# EAGLE design BVP (EAGLE 5.11)
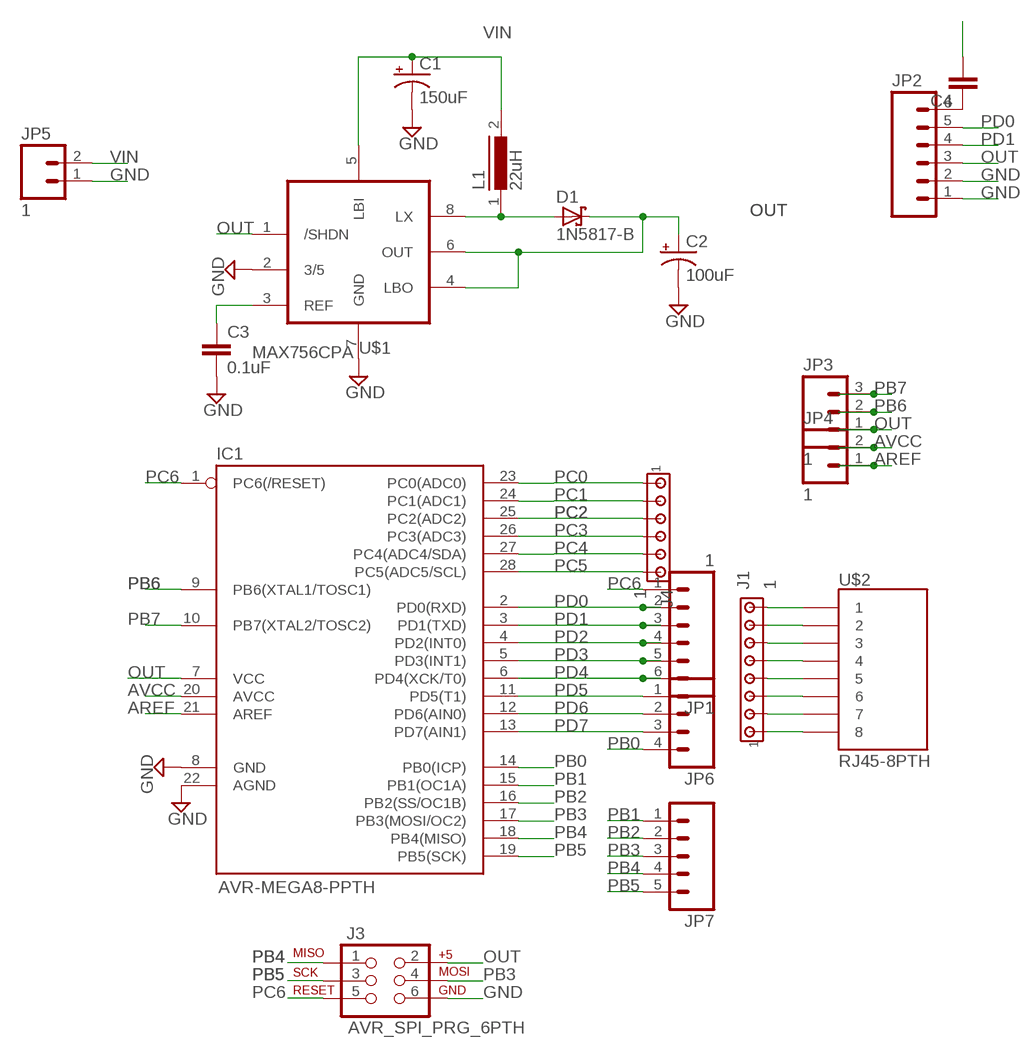
[diagram p0: schematic, sheet 1]

## Parts
C1  150uF  CAP_POLPTH1  [CPOL-RADIAL-100UF-25V]
C2  100uF  CAP_POLPTH1  [CPOL-RADIAL-100UF-25V]
C3  0.1uF  CAPPTH2  [CAP-PTH-SMALL2]
C4  CAPPTH  [CAP-PTH-SMALL]
D1  1N5817-B  [DO41-7.6]
IC1  AVR-MEGA8-PPTH  [DIL28-3]
J1  1  MTA08-100  [10X08MTA]
J3  AVR_SPI_PRG_6PTH  [2X3]
J4  1  MTA06-100  [10X06MTA]
JP1  1  M06SIP  [1X06]
JP2  M06SIP  [1X06]
JP3  1  M03PTH  [1X03]
JP4  1  M02PTH  [1X02]
JP5  1  M02PTH  [1X02]
JP6  M04PTH  [1X04]
JP7  M05PTH  [1X05]
L1  22uH  82114R  [82114R]
U$1  MAX756CPA  [DIL08]
U$2  RJ45-8PTH  [RJ45-8]

## Nets
AREF: IC1.21(AREF) JP4.1
AVCC: IC1.20(AVCC) JP4.2
GND: C1.2(-) C2.2(-) C3.2 IC1.8(GND) IC1.22(AGND) J3.6 JP2.1 JP2.2 JP5.1 U$1.2(3/5) U$1.7(GND)
N$1: D1.A L1.1 U$1.8(LX)
N$2: J1.8 U$2.1
N$3: C4.1 JP2.6
N$4: C3.1 U$1.3(REF)
N$5: J1.7 U$2.2
N$6: J1.6 U$2.3
N$7: J1.5 U$2.4
N$8: J1.4 U$2.5
N$9: J1.3 U$2.6
N$10: J1.2 U$2.7
N$11: J1.1 U$2.8
OUT: C2.1(+) D1.C IC1.7(VCC) J3.2 JP2.3 JP3.1 U$1.1(/SHDN) U$1.4(LBO) U$1.6(OUT)
PB0: IC1.14(PB0(ICP)) JP6.4
PB1: IC1.15(PB1(OC1A)) JP7.1
PB2: IC1.16(PB2(SS/OC1B)) JP7.2
PB3: IC1.17(PB3(MOSI/OC2)) J3.4 JP7.3
PB4: IC1.18(PB4(MISO)) J3.1 JP7.4
PB5: IC1.19(PB5(SCK)) J3.3 JP7.5
PB6: IC1.9(PB6(XTAL1/TOSC1)) JP3.2
PB7: IC1.10(PB7(XTAL2/TOSC2)) JP3.3
PC0: IC1.23(PC0(ADC0)) J4.6
PC1: IC1.24(PC1(ADC1)) J4.5
PC2: IC1.25(PC2(ADC2)) J4.4
PC3: IC1.26(PC3(ADC3)) J4.3
PC4: IC1.27(PC4(ADC4/SDA)) J4.2
PC5: IC1.28(PC5(ADC5/SCL)) J4.1
PC6: C4.2 IC1.1(PC6(/RESET)) J3.5 JP1.1
PD0: IC1.2(PD0(RXD)) JP1.2 JP2.5
PD1: IC1.3(PD1(TXD)) JP1.3 JP2.4
PD2: IC1.4(PD2(INT0)) JP1.4
PD3: IC1.5(PD3(INT1)) JP1.5
PD4: IC1.6(PD4(XCK/T0)) JP1.6
PD5: IC1.11(PD5(T1)) JP6.1
PD6: IC1.12(PD6(AIN0)) JP6.2
PD7: IC1.13(PD7(AIN1)) JP6.3
VIN: C1.1(+) JP5.2 L1.2 U$1.5(LBI)

## Library data of the parts
C1 C2 = SparkFun:CAP_POL: Capacitor Polarized These are standard SMD and PTH capacitors. Normally 10uF, 47uF, and 100uF in electrolytic and tantalum varieties. Always verify the external diameter of the through hole cap, it varies with capacity, voltage, and manufacturer. The EIA devices should be standard.
C3 C4 = SparkFun:CAP: Capacitor Standard 0603 ceramic capacitor, and 0.1" leaded capacitor.
D1 = diode:1N581*: 1.0A SCHOTTKY BARRIER RECTIFIER Source: http://www.diodes.com/datasheets/ds23001.pdf
IC1 = SparkFun:AVR-MEGA8-P: MICROCONTROLLER 8 Kbytes FLASH 1 kbytes SRAM 512 bytes EEPROM USART 4-channel 10 bit ADC 2-channel 8 bit ADC
J1 = con-amp:MTA08-100: AMP connector; OC_FARNELL: unknown; OC_NEWARK: unknown
J3 = SparkFun:AVR_SPI_PRG_6: AVR ISP 6 Pin This is the reduced ISP connector for AVR programming. Common on Arduino. This footprint will take up less PCB space and can be used with a 10-pin to 6-pin adapter such as SKU: BOB-08508
J4 = con-amp:MTA06-100: AMP connector; OC_FARNELL: unknown; OC_NEWARK: unknown
JP1 JP2 = SparkFun:M06: Header 6 Standard 6-pin 0.1" header. Use with straight break away headers (SKU : PRT-00116), right angle break away headers (PRT-00553), swiss pins (PRT-00743), machine pins (PRT-00117), and female headers (PRT-00115). Molex polarized connector foot print use with SKU : PRT-08094 with associated crimp pins and housings. NOTES ON THE VARIANTS LOCK and LOCK_LONGPADS... This footprint was designed to help hold the alignment of a through-hole component (i.e. 6-pin header) while soldering it into place. You may notice that each hole has been shifted either up or down by 0.005 of an inch from it's more standard position (which is a perfectly straight line). This slight alteration caused the pins (the squares in the middle) to touch the edges of the holes. Because they are alternating, it causes a "brace" to hold the component in place. 0.005 has proven to be the perfect amount of "off-center" position when using our standard breakaway headers. Although looks a little odd when you look at the bare footprint, once you have a header in there, the alteration is very hard to notice. Also, if you push a header all the way into place, it is covered up entirely on the bottom side. This idea of altering the position of holes to aid alignment will be further integrated into the Sparkfun Library for other footprints. It can help hold any component with 3 or more connection pins.
JP3 = SparkFun:M03: Header 3 Standard 3-pin 0.1" header. Use with straight break away headers (SKU : PRT-00116), right angle break away headers (PRT-00553), swiss pins (PRT-00743), machine pins (PRT-00117), and female headers (PRT-00115). Molex polarized connector foot print use with SKU : PRT-08232 with associated crimp pins and housings.
JP4 JP5 = SparkFun:M02: Header 2 Standard 2-pin 0.1" header. Use with straight break away headers (SKU : PRT-00116), right angle break away headers (PRT-00553), swiss pins (PRT-00743), machine pins (PRT-00117), and female headers (PRT-00115). Molex polarized connector foot print use with SKU : PRT-08233 with associated crimp pins and housings.
JP6 = SparkFun:M04: Header 4 Standard 4-pin 0.1" header. Use with straight break away headers (SKU : PRT-00116), right angle break away headers (PRT-00553), swiss pins (PRT-00743), machine pins (PRT-00117), and female headers (PRT-00115). Molex polarized connector foot print use with SKU : PRT-08231 with associated crimp pins and housings. 1MM SMD Version SKU: PRT-10208
JP7 = SparkFun:M05: Header 5 Standard 5-pin 0.1" header. Use with straight break away headers (SKU : PRT-00116), right angle break away headers (PRT-00553), swiss pins (PRT-00743), machine pins (PRT-00117), and female headers (PRT-00115). Molex polarized connector foot print use with SKU : PRT-08230 with associated crimp pins and housings.
L1 = inductors:82114R: INDUCTOR
U$1 = adafruit:MAX756
U$2 = SparkFun:RJ45-8: RJ45 Jack Simple RJ45, 8-pin connection - connector for common Cat5, Cat5e, and Cat6 Ethernet cables. Footprint not yet proven in production. Connector sku is PRT-00643; Breakout PCB sku is BOB-00716.

## Board
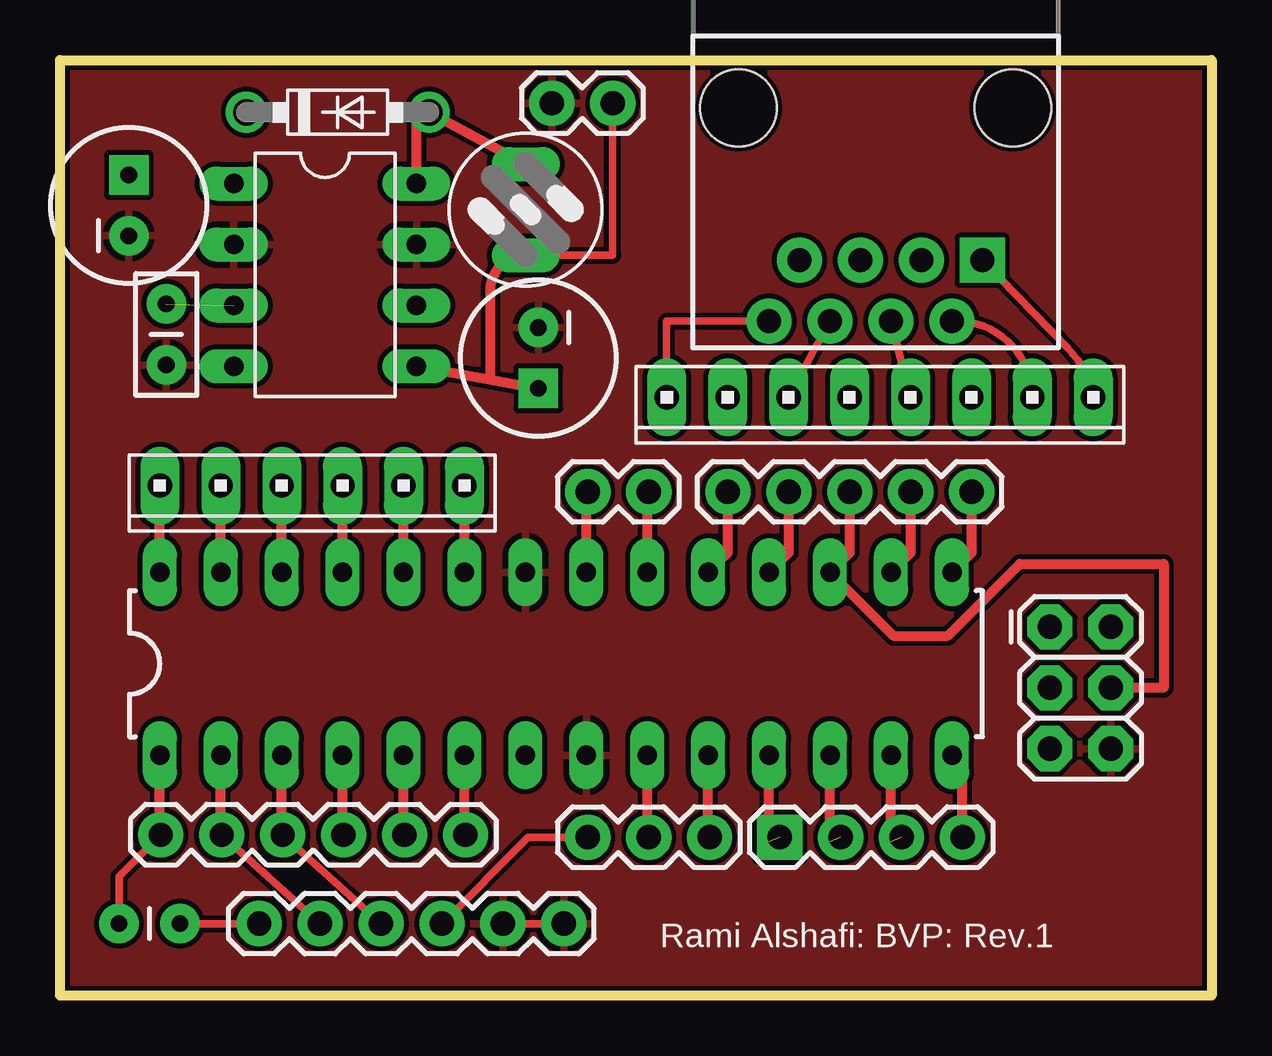
[diagram p1: board, top side]
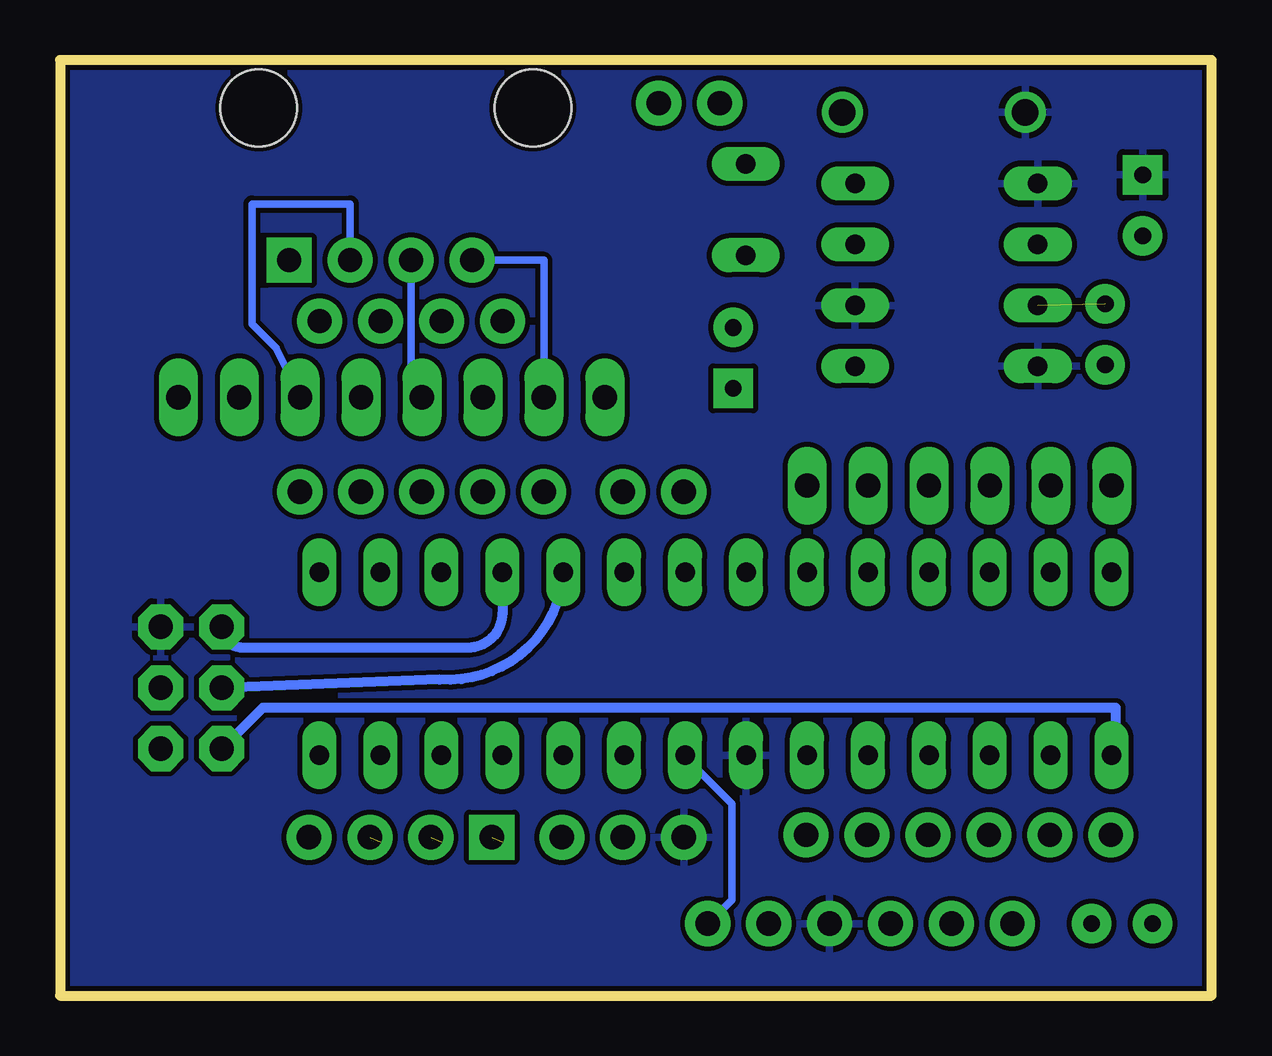
[diagram p2: board, bottom side, seen from below]

Size 48 x 39 mm. Coordinates in mm from the lower left corner, seen from the top.
Outline: 0,39 48,39 48,0 0,0 0,39
Copper layers (1*16): Top 0.035mm / dielectric 1.5mm / Bottom 0.035mm
Design rules "SparkFun-2-layer": minimum track width 7mil, minimum drill 15mil, track to track 8mil, track to pad 8mil, pad to pad 8mil, via to via 8mil, smd to smd 8mil, copper to edge 8mil, drill to drill 8mil, minimum pad ring 12mil, minimum via ring 10mil, stop-mask expansion 4mil, vias tented up to drill 20mil, thermal gap 10mil

### Footprints (pad centres in the part's own frame; a part is rotated, then mirrored left to right if it is on the bottom)
CPOL-RADIAL-100UF-25V = drill 0.7 pad 1.651 square: 1 1.27,0 | drill 0.7 pad 1.651 round: 2 -1.27,0
CAP-PTH-SMALL2 = drill 0.7 pad 1.651 round: 1 0,0; 2 2.54,0
CAP-PTH-SMALL = drill 0.7 pad 1.651 round: 1 0,0; 2 2.54,0
DO41-7.6 = drill 1.1 pad 1.7 round: A 3.81,0; C -3.81,0
DIL28-3 = drill 0.813 long: 1 -16.51,-3.81; 2 -13.97,-3.81; 3 -11.43,-3.81; 4 -8.89,-3.81; 5 -6.35,-3.81; 6 -3.81,-3.81; 7 -1.27,-3.81; 8 1.27,-3.81; 9 3.81,-3.81; 10 6.35,-3.81; 11 8.89,-3.81; 12 11.43,-3.81; 13 13.97,-3.81; 14 16.51,-3.81; 15 16.51,3.81; 16 13.97,3.81; 17 11.43,3.81; 18 8.89,3.81; 19 6.35,3.81; 20 3.81,3.81; 21 1.27,3.81; 22 -1.27,3.81; 23 -3.81,3.81; 24 -6.35,3.81; 25 -8.89,3.81; 26 -11.43,3.81; 27 -13.97,3.81; 28 -16.51,3.81
10X08MTA = drill 1.016 long: 1 8.89,0; 2 6.35,0; 3 3.81,0; 4 1.27,0; 5 -1.27,0; 6 -3.81,0; 7 -6.35,0; 8 -8.89,0
2X3 = drill 1.016 pad 1.88 octagon: 1 0,0; 2 0,2.54; 3 2.54,0; 4 2.54,2.54; 5 5.08,0; 6 5.08,2.54
10X06MTA = drill 1.016 long: 1 6.35,0; 2 3.81,0; 3 1.27,0; 4 -1.27,0; 5 -3.81,0; 6 -6.35,0
1X06 = drill 1.016 pad 1.88 round: 1 0,0; 2 2.54,0; 3 5.08,0; 4 7.62,0; 5 10.16,0; 6 12.7,0
1X03 = drill 1.016 pad 1.88 round: 1 0,0; 2 2.54,0; 3 5.08,0
1X02 = drill 1.016 pad 1.88 round: 1 0,0; 2 2.54,0
1X04 = drill 1.016 pad 1.88 square: 1 0,0 | drill 1.016 pad 1.88 round: 2 2.54,0; 3 5.08,0; 4 7.62,0
1X05 = drill 1.016 pad 1.88 round: 1 0,0; 2 2.54,0; 3 5.08,0; 4 7.62,0; 5 10.16,0
82114R = drill 0.813 long: 1 0,1.905; 2 0,-1.905
DIL08 = drill 0.813 long: 1 -3.81,-3.81; 2 -1.27,-3.81; 3 1.27,-3.81; 4 3.81,-3.81; 5 3.81,3.81; 6 1.27,3.81; 7 -1.27,3.81; 8 -3.81,3.81
RJ45-8 = drill 1 pad 1.88 square: 1 -4.445,6.35 | drill 1 pad 1.88 round: 2 -3.175,8.89; 3 -1.905,6.35; 4 -0.635,8.89; 5 0.635,6.35; 6 1.905,8.89; 7 3.175,6.35; 8 4.445,8.89 | hole 3.2: -5.715,0; 5.715,0

### Placement (x,y rotation side)
C1  19.94,26.58 270 top
C2  2.87,32.94 90 top
C3  4.43,28.83 270 top
C4  5,3 180 top
D1  11.58,36.82 0 top
IC1  20.67,13.83 0 top
J1  34.18,24.94 180 top
J3  41.26,15.37 270 top
J4  10.51,21.26 180 top
JP1  4.2,6.7 0 top
JP2  21,3 180 top
JP3  22,6.6 0 top
JP4  22,21 0 top
JP5  20.5,37.2 0 top
JP6  30,6.6 0 top
JP7  38,21 180 top
L1  19.41,32.76 0 top
U$1  11.05,30.04 270 top
U$2  34,37 180 top

### Tracks (layer width: path | path; a pad name or v marks a point on that pad's centre or on a via)
AREF
  Top 0.406: JP4.1 21.94,21 IC1.21
AVCC
  Top 0.406: JP4.2 24.48,21 IC1.20
GND
  Top 0.305: JP2.2 JP2.1
  Bottom 0.305: JP2.1 20,4 20,8 21.94,9.94 IC1.8
  pour Top: 0,39 48,39 48,0 0,0
N$1
  Top 0.406: U$1.8 14.86,36.29 arc-90 D1.A L1.1
N$2
  Top 0.305: U$2.1 42,27 arc-34 J1.8
N$3
  Top 0.305: C4.1 JP2.6
N$4  (1 unrouted)
N$5
  Top 0.305: U$2.2 37.36,28.11 arc-90 J1.7
N$6
  Bottom 0.305: U$2.3 35.91,33 40,33 40,28 39,27 J1.6
N$7
  Top 0.305: J1.5 U$2.4
N$8
  Bottom 0.305: U$2.5 33.37,25.39 J1.4
N$9
  Top 0.305: J1.3 U$2.6
N$10
  Bottom 0.305: U$2.7 27.83,30.65 J1.2
N$11
  Top 0.305: U$2.8 25.29,28.11 J1.1
OUT
  Top 0.305: JP2.3 19.52,6.6 JP3.1
  pour Bottom: 0,39 48,39 48,0 0,0
PB0
  Top 0.406: 37.18,10 IC1.14 37.62,9.58 JP6.4
PB1
  Top 0.406: JP7.1 38,18.46 IC1.15
PB2
  Top 0.406: JP7.2 35.46,18.46 IC1.16
PB3
  Top 0.406: J3.4 46,12.83 46,18 40,18 37,15 34.74,15 IC1.17 32.92,18.46 JP7.3
PB4
  Top 0.406: JP7.4 30.38,18.46 IC1.18
  Bottom 0.406: J3.1 arc-90 40.39,14.5 31,14.5 arc-90 29.56,15.94 IC1.18
PB5
  Top 0.406: JP7.5 27.84,18.46 IC1.19
  Bottom 0.406: J3.3 32.17,13.17 arc-90 IC1.19
PB6
  Top 0.406: JP3.2 24.48,6.6 IC1.9
PB7
  Top 0.406: JP3.3 27.02,6.6 IC1.10
PC0
  Top 0.406: IC1.23 J4.6
PC1
  Top 0.406: IC1.24 J4.5
PC2
  Top 0.406: IC1.25 J4.4
PC3
  Top 0.406: IC1.26 J4.3
PC4
  Top 0.406: IC1.27 J4.2
PC5
  Top 0.406: IC1.28 J4.1
PC6
  Top 0.305: C4.2 2.46,4.96 JP1.1
  Top 0.406: JP1.1 4.16,6.7 IC1.1
  Bottom 0.406: IC1.1 4,10.02 4,12 39.55,12 J3.5
PD0
  Top 0.305: JP1.2 JP2.5
  Top 0.406: JP1.2 6.7,6.7 IC1.2
PD1
  Top 0.305: JP1.3 JP2.4
  Top 0.406: JP1.3 9.24,6.7 IC1.3
PD2
  Top 0.406: JP1.4 11.78,6.7 IC1.4
PD3
  Top 0.406: JP1.5 14.32,6.7 IC1.5
PD4
  Top 0.406: JP1.6 16.86,6.7 IC1.6
PD5  (1 unrouted)
  Top 0.406: 29.56,6.4 IC1.11
PD6  (1 unrouted)
  Top 0.406: 32.1,6.4 IC1.12
PD7  (1 unrouted)
  Top 0.406: 34.64,6.4 IC1.13
VIN
  Top 0.305: JP5.2 23.04,30.86 L1.2
  Top 0.406: U$1.5 17.94,25.67 | 17.94,25.67 C1.1 | L1.2 arc90 17.94,29.39 17.94,25.67

### Text on the board
tPlace: Rami Alshafi: BVP: Rev.1